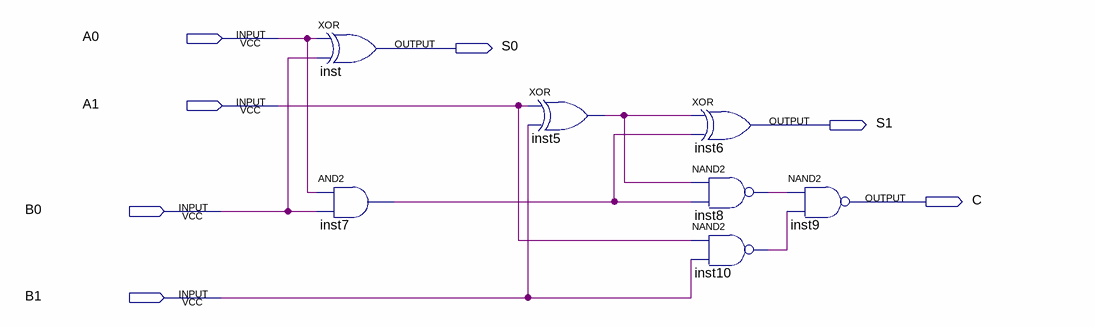
[diagram p0: schematic sheet]
// Quartus schematic Experiment2.bdf as structural Verilog: 7 symbols, 7 pins
module Experiment2 (
  input  A0,
  input  A1,
  input  B0,
  input  B1,
  output S0,
  output S1,
  output C
);

  wire inst5_out, inst7_out, inst8_out, inst10_out;

  xor inst (S0, A0, B0);
  and inst7 (inst7_out, A0, B0);
  xor inst5 (inst5_out, A1, B1);
  xor inst6 (S1, inst5_out, inst7_out);
  nand inst8 (inst8_out, inst5_out, inst7_out);
  nand inst10 (inst10_out, A1, B1);
  nand inst9 (C, inst8_out, inst10_out);
endmodule
